# Altium schematic sheet Sheet_1_2021-12-20.schdoc
size 49 x 29 mm
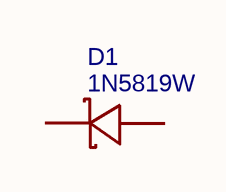
[diagram p0: Sheet_1_2021-12-20.schdoc]

## Parts
D1  1N5819W  [SOD-123F_L2.8-W1.8-LS3.7-RD]

## Nets

Not connected (* = marked no-connect by the designer): D1 1 2

## Library data of the parts
D1 = 1N5819W: BOM_Manufacturer: Shandong Jingdao Microelectronics; Contributor: LCSC; BOM_Supplier: LCSC; BOM_Supplier Part: C169540; BOM_Manufacturer Part: 1N5819W; BOM_JLCPCB Part Class: Extended Part; spicePre: D; spiceSymbolName: 1N5819W